# EAGLE design relay (EAGLE 6.1)
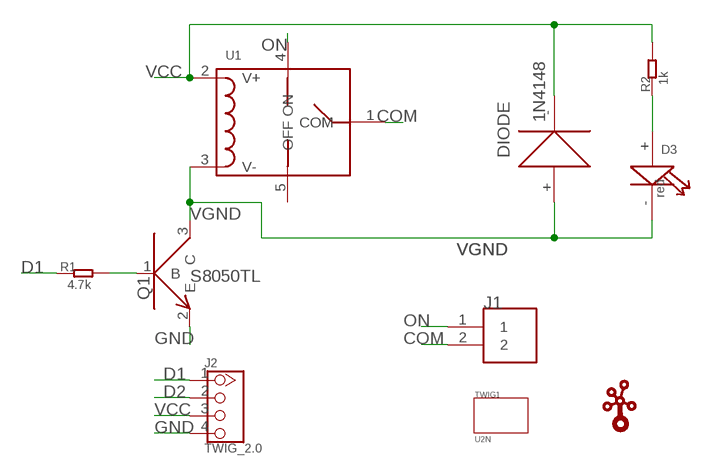
[diagram p0: schematic, sheet 1]

## Parts
D3  red  LED0805  [LED0805]
DIODE  1N4148  DIODE1206  [DIODE1206]
J1  CON2  [CON2]
J2  TWIG_2.0  [2.0_1X4]
Q1  NPN_9013  [SOT23]
R1  4.7k  R0603  [0603]
R2  1k  R0603  [0603]
TWIG1  U2N  [U2N]
U1  RELAY  [RELAY]
U$1  TWIGLOGOTWIGLOGO_SMALL  [TWIGLOGO_SMALL]

## Nets
COM: J1.2 U1.1(COM)
D1: J2.1 R1.1
D2: J2.2
GND: J2.4 Q1.2(E)
N$1: D3.+ R2.1
N$2: Q1.1(B) R1.2
ON: J1.1 U1.4(ON)
VCC: DIODE.- J2.3 R2.2 U1.2(V+)
VGND: D3.- DIODE.+ Q1.3(C) U1.3(V-)
Unconnected: U1.5(OFF)

## Notes on the sheet
- S8050TL

## Library data of the parts
D3 = CPT_SMD:LED0805
DIODE = CPT_SMD:DIODE
J1 = seeedleo:CON2
J2 = CONNECTER:TWIG_2.0
Q1 = CPT_SMD:NPN_9013
R1 R2 = CPT_SMD:R0603
TWIG1 = twig_template1:U2N
U1 = Seeed:RELAY
U$1 = seeedleo:TWIGLOGO

## Board
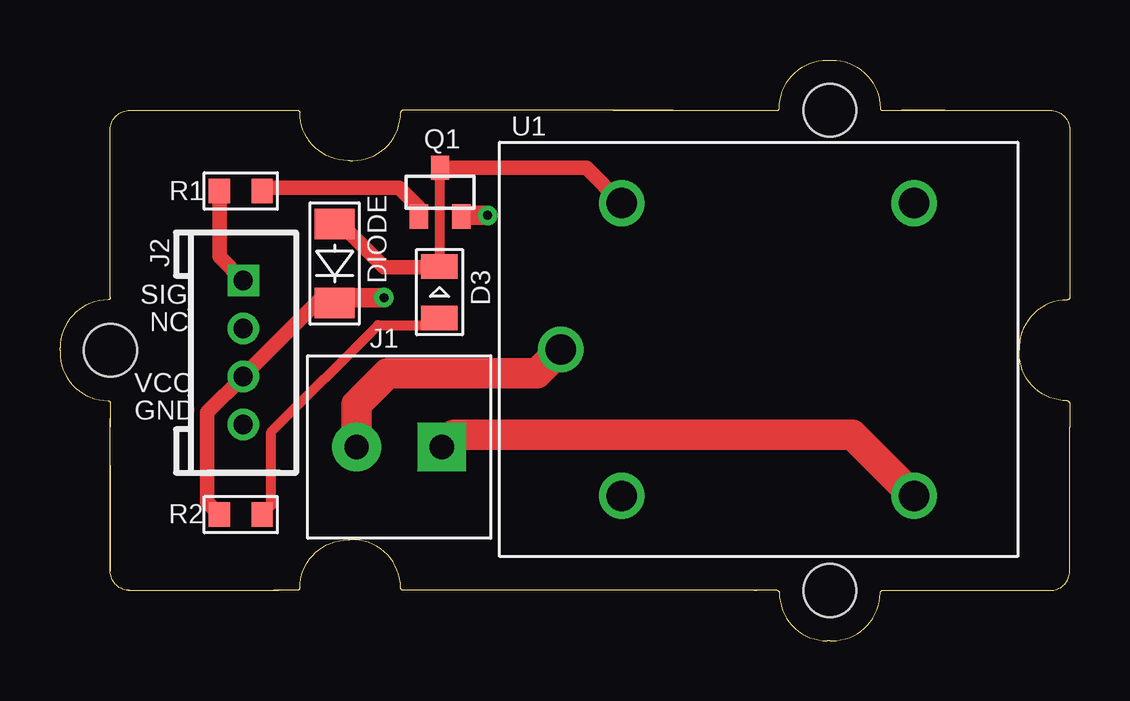
[diagram p1: board, top side]
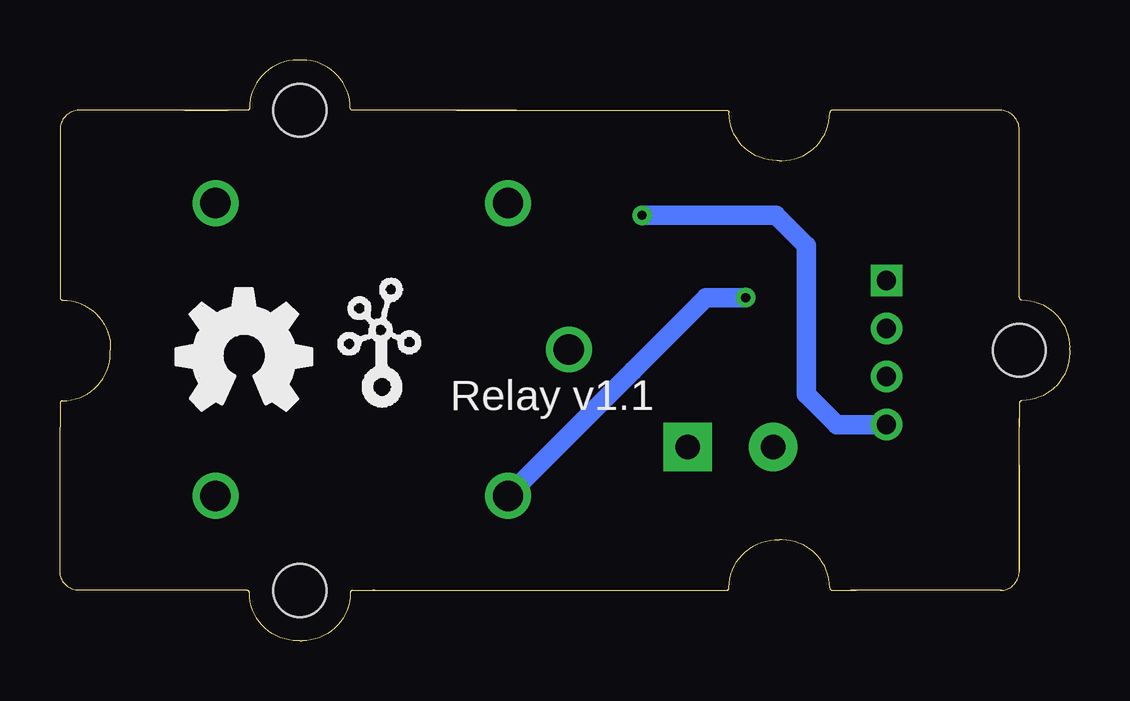
[diagram p2: board, bottom side, seen from below]

Size 42.09 x 24.2 mm. Coordinates in mm from the lower left corner, seen from the top.
Copper layers (1*16): Top 0.035mm / dielectric 1.5mm / Bottom 0.035mm
Design rules: minimum track width 6mil, minimum drill 12mil, track to track 6mil, track to pad 6mil, pad to pad 6mil, via to via 6mil, smd to smd 0mil, copper to edge 10mil, drill to drill 10mil, minimum pad ring 10mil, minimum via ring 6mil, stop-mask expansion 2mil, vias tented up to drill 100mil, thermal gap 10mil

### Footprints (pad centres in the part's own frame; a part is rotated, then mirrored left to right if it is on the bottom)
LED0805 = smd 1.016 x 1.524: + -1.077,0; - 1.077,0
DIODE1206 = smd 1.27 x 1.651: + -1.651,0; - 1.651,0
CON2 = drill 1.016 pad 2.032 square: 1 0,1.778 | drill 1.016 pad 2.032: 2 0,-1.778
2.0_1X4 = drill 0.8 pad 1.27 square: 1 -3,0 | drill 0.8 pad 1.27: 2 -1,0; 3 1,0; 4 3,0
SOT23 = smd 0.762 x 1.016: 1 -0.889,-1.016; 2 0.889,-1.016; 3 0,1.016
0603 = smd 0.889 x 1.016: 1 -0.889,0; 2 0.889,0
U2N = hole 2.2: 10.453,-10.42; 10.453,9.58; -19.535,-0.415
RELAY = drill 1.27: 1 -2.54,-6.096; 2 0,-12.192; 3 0,0; 4 12.192,-12.192; 5 12.192,0

### Placement (x,y rotation side)
D3  15.82,14.53 90 top
DIODE  11.45,15.72 270 top
J1  14.14,8.07 270 top
J2  7.64,12.01 270 top
Q1  15.84,18.69 0 top
R1  7.54,18.74 0 top
R2  7.54,5.26 180 top
TWIG1  21.64,12.52 0 top
U1  23.41,18.23 0 top
U$1  30.91,9.6 0 bottom
U$2  [OSHW_FILLX200_NOTEXT]  37.26,9.6 0 bottom

### Tracks (layer width: path | path; a pad name or v marks a point on that pad's centre or on a via)
COM
  Top 1.27: J1.2 12.36,9.85 13.66,11.15 19.88,11.15 U1.1
D1
  Top 0.61: R1.1 6.65,16 J2.1
GND  (via drill 0.38 pad 0.81)
  Top 0.406: 16.68,17.73 Q1.2 16.78,17.73 16.81,17.73
  Top 0.813: v17.83,17.73 16.81,17.73
  Bottom 0.813: J2.4 9.7,9.01 10.97,10.28 10.97,16.46 12.24,17.73 v17.83,17.73
N$1
  Top 0.406: D3.+ 15.33,13.45 15.33,13.27 15.44,13.15 13.25,13.15 8.81,8.71 8.81,5.64 R2.1
N$2
  Top 0.61: Q1.1 14.96,18.06 14.14,18.87 8.55,18.87 R1.2
ON
  Top 1.27: U1.4 35.58,6.04 33.04,8.58 16.43,8.58 J1.1
VCC  (via drill 0.38 pad 0.81)
  Top 0.61: R2.2 6.14,5.76 6.14,9.51 J2.3 7.64,11.02 10.89,14.27 11.25,14.27 DIODE.-
  Top 0.813: v13.51,14.3 11.45,14.3 DIODE.-
  Bottom 0.813: v13.51,14.3 15.16,14.3 18.21,11.25 U1.2
VGND
  Top 0.305: D3.- 15.84,15.63
  Top 0.406: 15.84,15.63 Q1.3
  Top 0.61: Q1.3 21.94,19.71 U1.3 | DIODE.+ 11.7,17.37 13.51,15.57 15.78,15.57 D3.-

### Text on the board
tPlace: SIG | NC | VCC | GND
bPlace: Relay v1.1